# Altium project hc_module_esp32_dan.PrjPcb
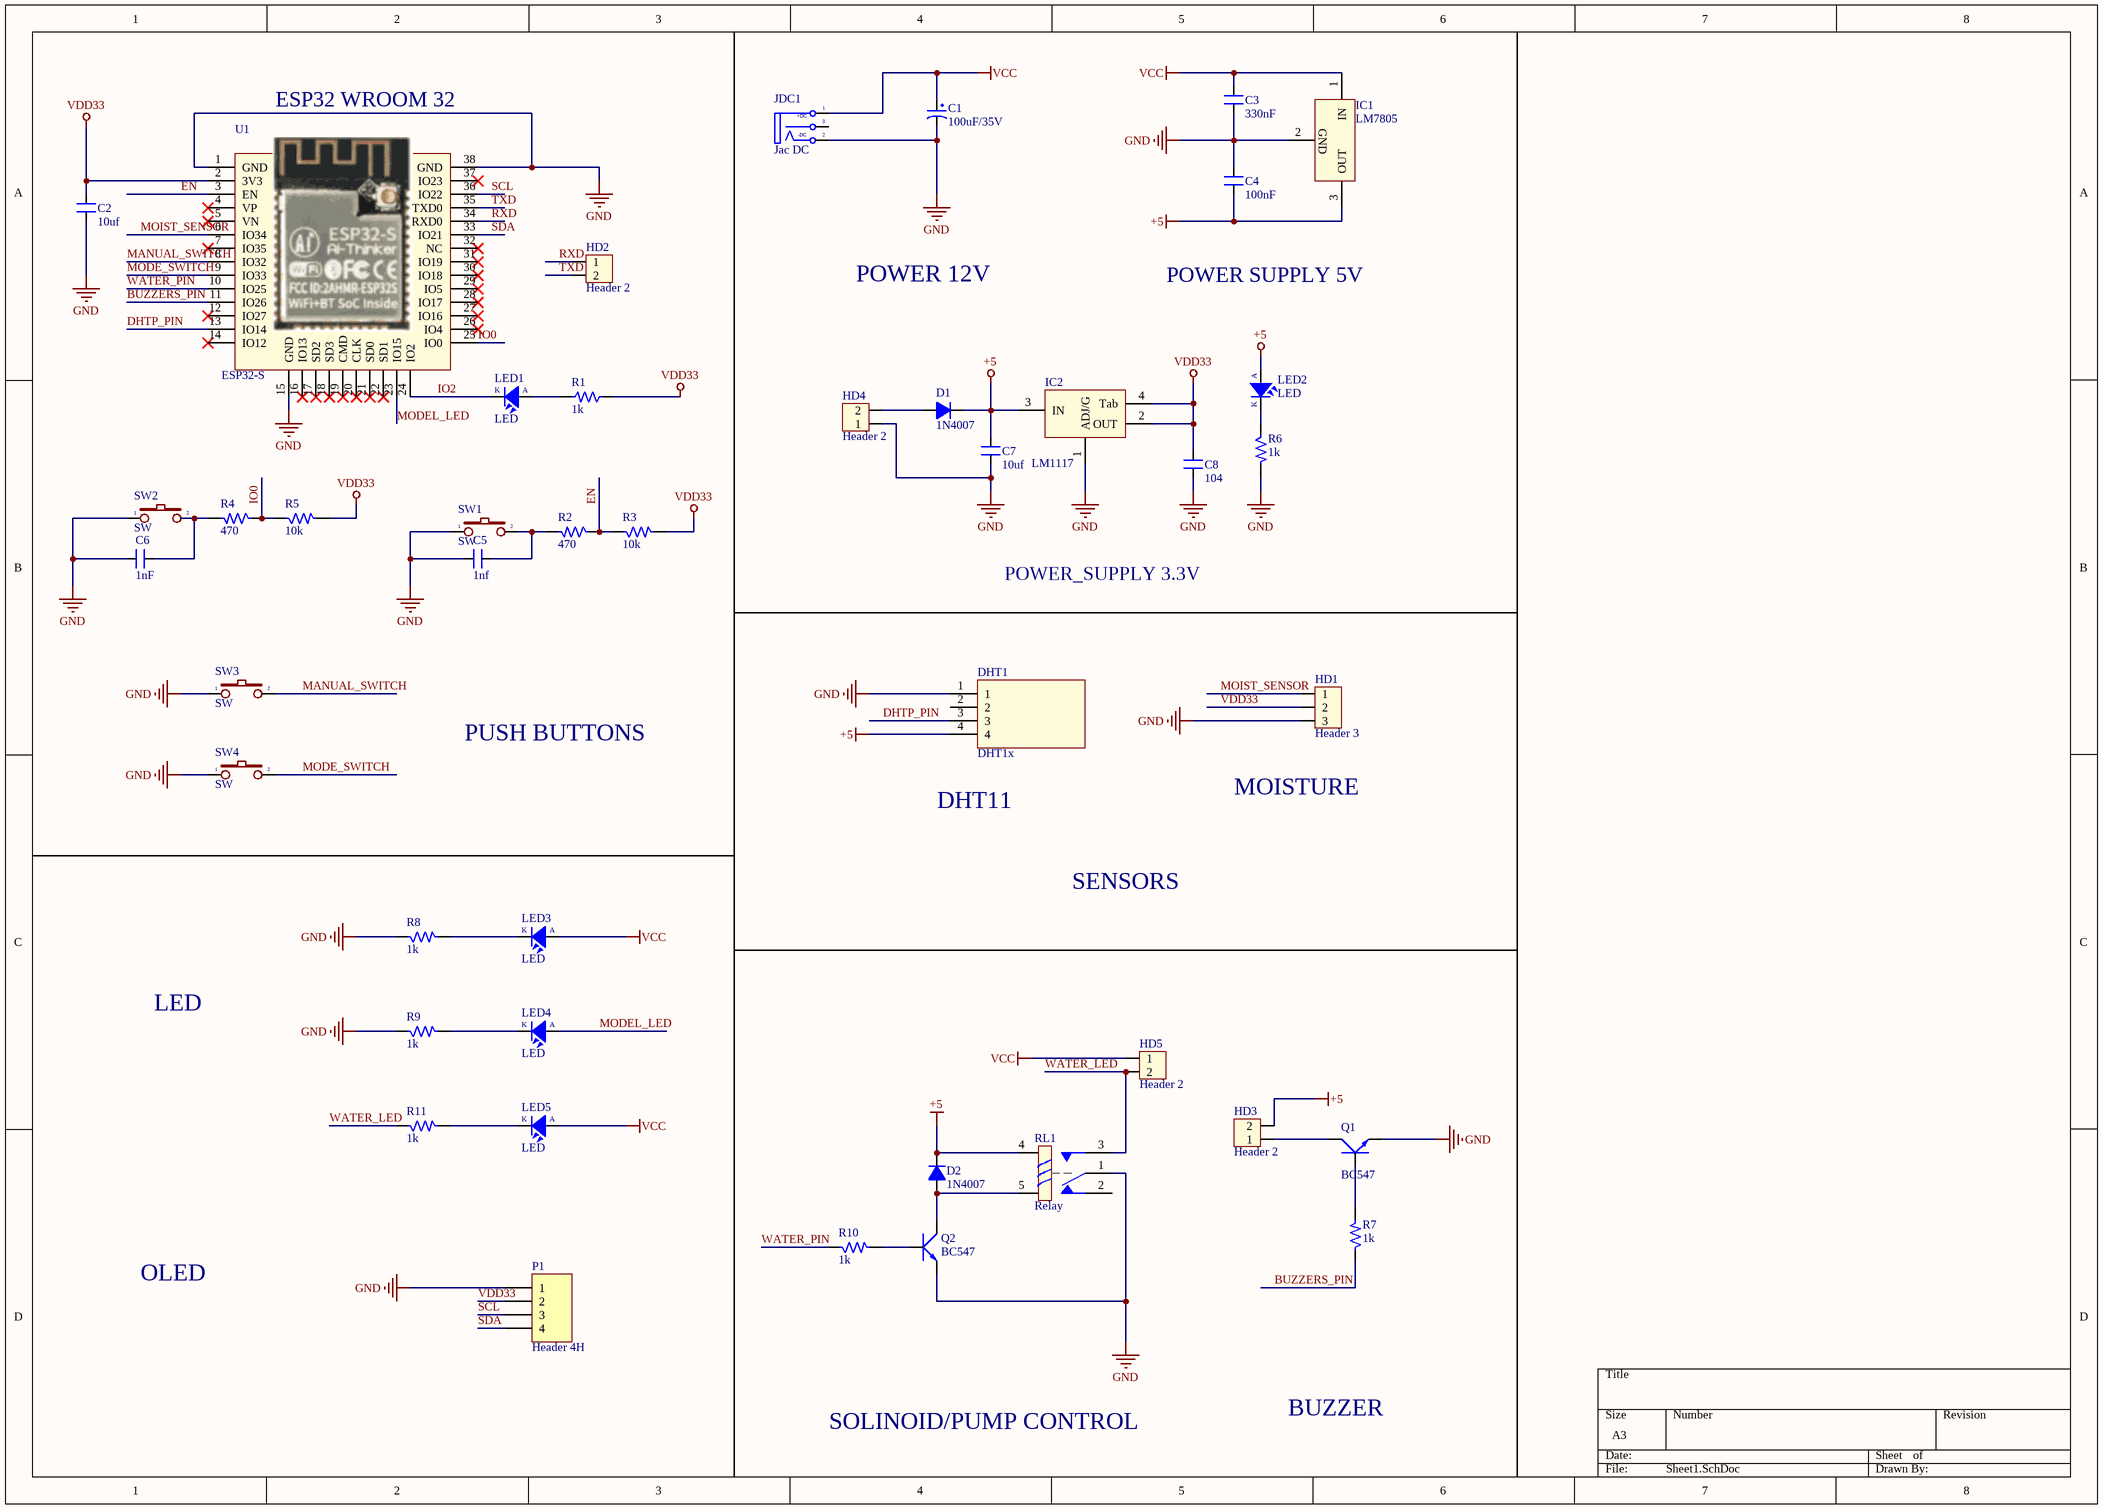
[diagram p0: Sheet1.SchDoc]
1 sheet, 44 parts. Net scope: global (net labels, ports and power ports of the same name join across sheets).
Board file: Duong_update.PcbDoc

## Sheet Sheet1.SchDoc
size A3

### Parts
C1  100uF/35V  [CP1.5/3.4]
C2  10uf  [CM-1206]
C3  330nF  [CM-0805]
C4  100nF  [CM-0805]
C5  1nf  [CM-0805]
C6  1nF  [CM-0805]
C7  10uf  [CM-0805]
C8  104  [CM-0805]
D1  1N4007  [D-0805 SOD323]
D2  1N4007  [D-0805 SOD323]
DHT1  DHT1x  [jp4]
HD1  Header 3  [HED3]
HD2  Header 2  [HED2]
HD3  Header 2  [HED2]
HD4  Header 2  [HED2]
HD5  Header 2  [HED2]
IC1  LM7805  [QTO-220H1]
IC2  LM1117  [SOT223-4N]
JDC1  Jac DC  [DC-IN]
LED1  LED  [LED-0805]
LED2  LED  [LED-0805]
LED3  LED  [LED-0805]
LED4  LED  [LED-0805]
LED5  LED  [LED-0805]
P1  Header 4H  [HDR1X4H]
Q1  BC547  [QTO-92]
Q2  BC547  [QTO-92]
R1  1k  [RM-1206]
R2  470  [RM-0805]
R3  10k  [RM-1206]
R4  470  [RM-0805]
R5  10k  [RM-1206]
R6  1k  [RM-0805]
R7  1k  [RM-1206]
R8  1k  [RM-1206]
R9  1k  [RM-1206]
R10  1k  [RM-1206]
R11  1k  [RM-1206]
RL1  Relay  [Relay HK23F]
SW1  SW  [SW-SMD3*6]
SW2  SW  [SW-SMD3*6]
SW3  SW  [SW-SMD3*6]
SW4  SW  [SW-SMD3*6]
U1  ESP32-S  [ESP-32WR]

### Nets
+5: C4.1 C7.2 D1.2(K) D2.2(K) DHT1.4 HD3.2 IC1.3(OUT) IC2.3(IN) LED2.1(A) RL1.4
GND: C1.2 C2.1 C3.1 C4.2 C5.2 C6.2 C7.1 C8.1 DHT1.1 HD1.3 HD4.1 IC1.2(GND) IC2.1(ADJ/G) JDC1.2(TN) P1.1 Q1.3(E) Q2.3(E) R6.2 R8.1 R9.1 RL1.1 SW1.1 SW2.1 SW3.1 SW4.1 U1.1(GND) U1.15(GND) U1.38(GND)
VCC: C1.1 C3.2 HD5.1 IC1.1(IN) JDC1.1(+DC) LED3.1(A) LED5.1(A)
VDD33: C2.2 C8.2 HD1.2 IC2.2(OUT) IC2.4(Tab) P1.2 R1.1 R3.2 R5.2 U1.2(3V3)
BUZZERS_PIN: R7.1 U1.11(IO26)
DHTP_PIN: DHT1.3 U1.13(IO14)
EN: R2.1 R3.1 U1.3(EN)
IO0: R4.1 R5.1 U1.25(IO0)
IO2: LED1.2(K) U1.24(IO2)
MANUAL_SWITCH: SW3.2 U1.8(IO32)
MODE_SWITCH: SW4.2 U1.9(IO33)
MODEL_LED: LED4.1(A) U1.23(IO15)
MOIST_SENSOR: HD1.1 U1.6(IO34)
RXD: HD2.1 U1.34(RXD0)
SCL: P1.3 U1.36(IO22)
SDA: P1.4 U1.33(IO21)
TXD: HD2.2 U1.35(TXD0)
WATER_LED: HD5.2 R11.1 RL1.3
WATER_PIN: R10.1 U1.10(IO25)
NetC5_1: C5.1 R2.2 SW1.2
NetC6_1: C6.1 R4.2 SW2.2
NetD1_1: D1.1(A) HD4.2
NetD2_1: D2.1(A) Q2.1(C) RL1.5
NetHD3_1: HD3.1 Q1.1(C)
NetLED1_1: LED1.1(A) R1.2
NetLED2_2: LED2.2(K) R6.1
NetLED3_2: LED3.2(K) R8.2
NetLED4_2: LED4.2(K) R9.2
NetLED5_2: LED5.2(K) R11.2
NetQ1_2: Q1.2(B) R7.2
NetQ2_2: Q2.2(B) R10.2

Not connected (* = marked no-connect by the designer): DHT1 2; JDC1 3(S); RL1 2; U1 4(VP)* 5(VN)* 7(IO35)* 12(IO27)* 14(IO12)* 16(IO13)* 17(SD2)* 18(SD3)* 19(CMD)* 20(CLK)* 21(SD0)* 22(SD1)* 26(IO4)* 27(IO16)* 28(IO17)* 29(IO5)* 30(IO18)* 31(IO19)* 32(NC)* 37(IO23)*

### Notes on the sheet
- ESP32 WROOM 32
- POWER 12V
- POWER SUPPLY 5V
- POWER_SUPPLY 3.3V
- PUSH BUTTONS
- DHT11
- MOISTURE
- SENSORS
- LED
- OLED
- SOLINOID/PUMP CONTROL
- BUZZER
- (in symbol DCIN) -DC

### Library data of the parts
C1 = CP3: Cap 100uF/35V - 470uF/16V; Value: 100uF/35V/50V; Description 1: 1000uF/6,3V - 470uF/16V - 330uF - 25V; Description 2: 220uF/35V - 100uF/50V - 63V - 4,7uF/200V; Description 3: 22uF => 33uF100V - 3,3uF => 4,7uF/250V; Description 4: 2,2uF =>3,3uF/350 - 2,2uF/400V - 1uF/450V
C2-C8 = CM: Cap SMD; Value: 103
D1 D2 = D1A: Diode 1A; Value: 1N4007
DHT1 = DHT1x: Humidity and Temperature Sensor
HD1 = Hed3: Header 3 (Green); Value: Header 3
HD2-HD5 = Hed2: Header 2 (Green); Value: Header 2
IC1 = LM78xx: On ap +, from + 5 to + 24VDC; Value: LM7805
IC2 = LM1117: 3v3; Value: LM317
JDC1 = DCIN: Jac DC input; Value: Jac DC
LED1-LED5 = LED: LED Single colour Green and Red; Value: LED 3 ly Single Colour
P1 = Header 4H: Header, 4-Pin, Right Angle; LatestRevisionDate: 17-Jul-2002; LatestRevisionNote: Re-released for DXP Platform.; Publisher: Altium Limited
Q1 Q2 = BC547: P 600mW, CBE; Value: BC547
R1-R11 = R: Resistor 1/4W; Value: R1/4W - 1K
RL1 = Relay 1: Relay SPDT 5 Pin; Value: Relay SPDT, 10A, 12V
SW1-SW4 = SW2: Switch button 2 pin; Value: SW chip 2 pin